# EAGLE design CiderPress (EAGLE 7.5.0)
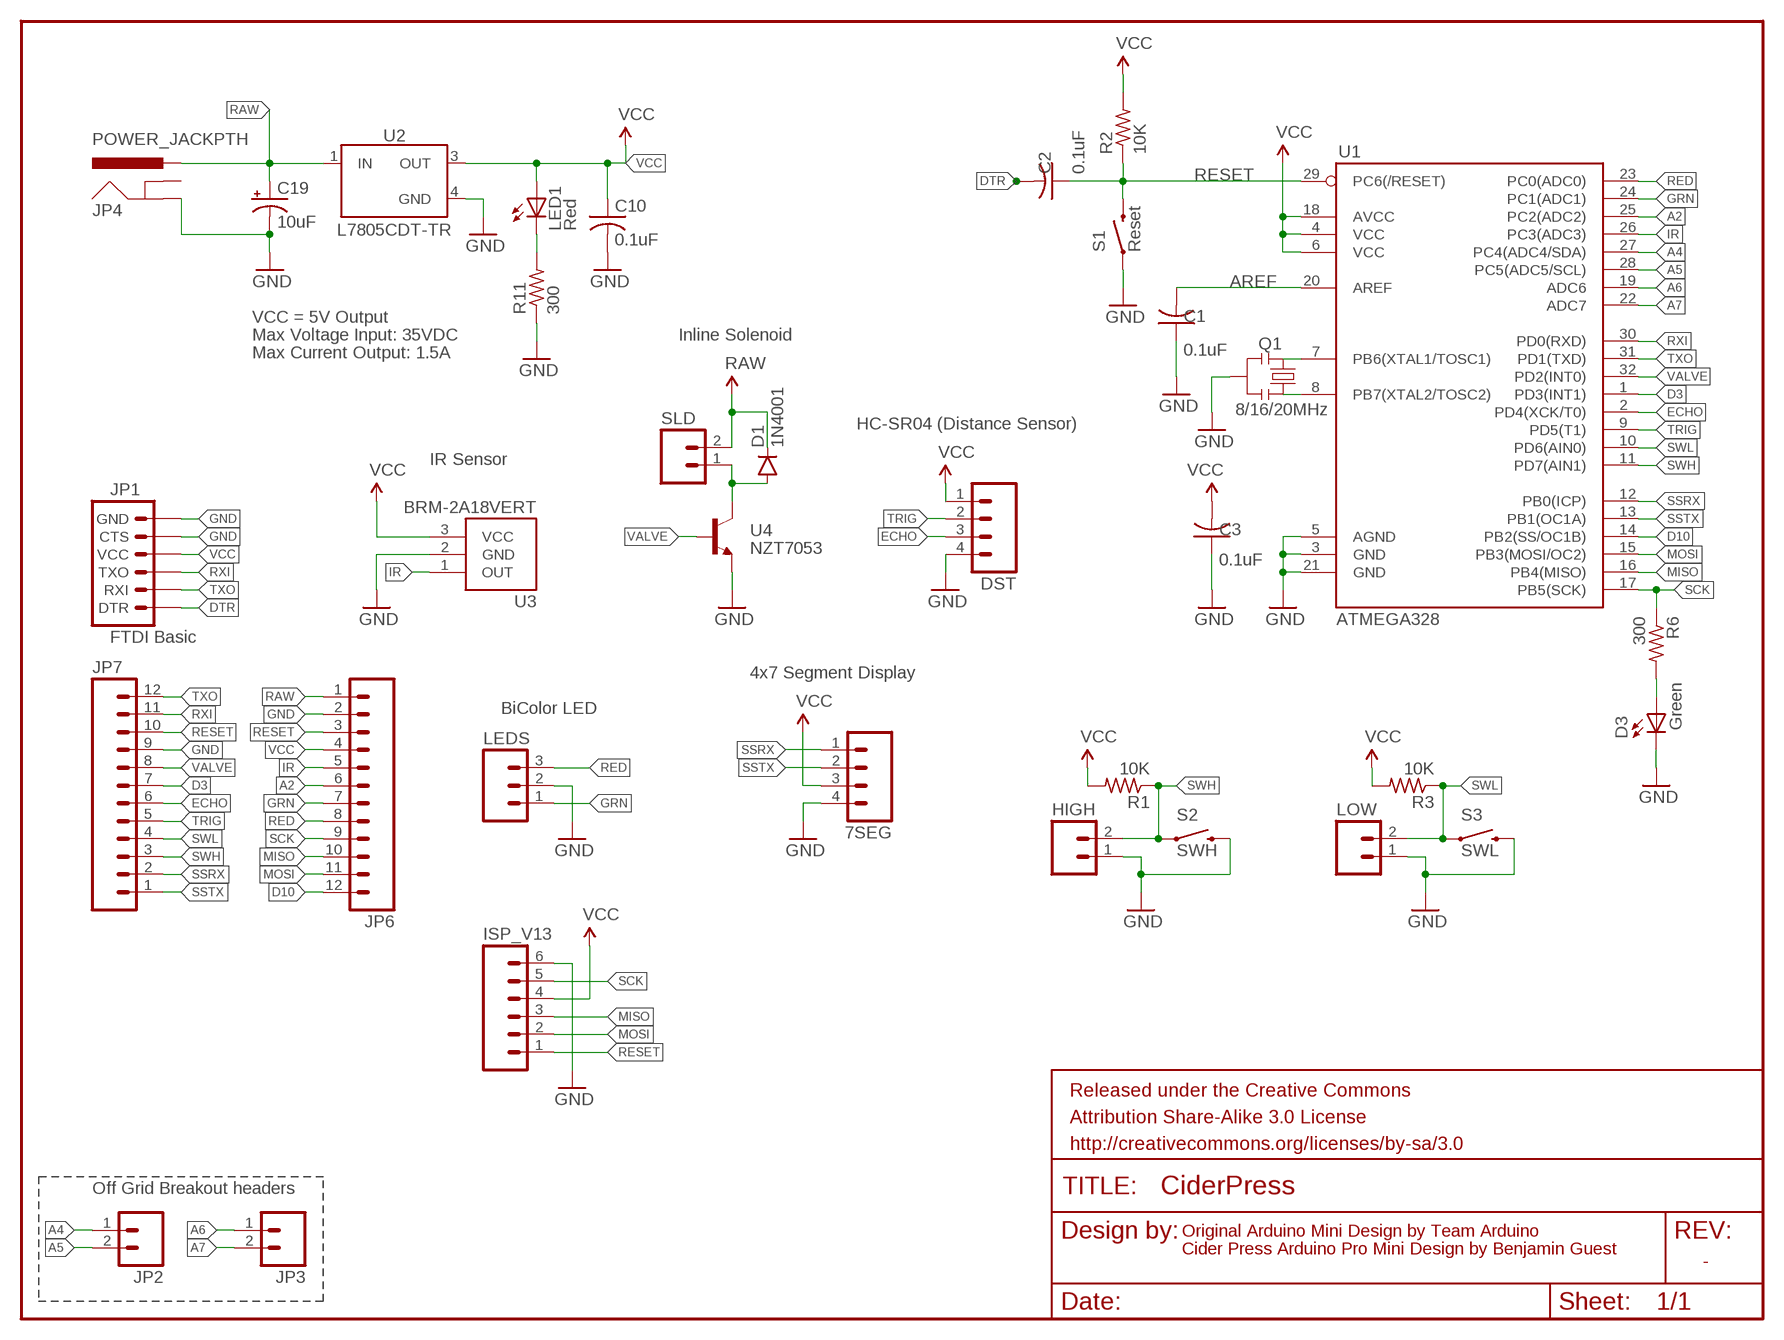
[diagram p0: schematic, sheet 1]

## Parts
7SEG  M04JST-PTH  [JST-4-PTH]
C1  0.1uF  C-USC0805  [C0805]
C2  0.1uF  C-USC0805  [C0805]
C3  0.1uF  C-USC0805  [C0805]
C10  0.1uF  C-USC0805  [C0805]
C19  10uF  CAP_POL1206  [EIA3216]
D1  1N4001  DIODEKIT2  [DIODE-1N4001-KIT]
D3  Green  LEDCHIPLED_0805  [CHIPLED_0805]
DST  M04JST-PTH  [JST-4-PTH]
FRAME1  FRAME-LETTER  [CREATIVE_COMMONS]
HIGH  M02JST-PTH-2  [JST-2-PTH]
ISP_V13  M06SIP  [1X06]
JP1  FTDI Basic  ARDUINO_SERIAL_PROGRAMPTH  [1X06]
JP2  M02PTH  [1X02]
JP3  M02PTH  [1X02]
JP4  POWER_JACKPTH  [POWER_JACK_PTH]
JP6  M12PTH  [1X12]
JP7  M12PTH  [1X12]
LED1  Red  LEDCHIPLED_0805  [CHIPLED_0805]
LEDS  M03JST-PTH  [JST-3-PTH]
LOW  M02JST-PTH-2  [JST-2-PTH]
Q1  8/16/20MHz  RESONATOR1:1  [RESONATOR-SMD-1:1]
R1  10K  R-US_M0805  [M0805]
R2  10K  R-US_M0805  [M0805]
R3  10K  R-US_M0805  [M0805]
R6  300  R-US_M0805  [M0805]
R11  300  R-US_M0805  [M0805]
S1  Reset  SWITCH-MOMENTARY-2SMD-ALT01  [TACTILE-SWITCH-SMD-ALT01]
S2  SWH  SWITCH-MOMENTARY-2SMD-ALT01  [TACTILE-SWITCH-SMD-ALT01]
S3  SWL  SWITCH-MOMENTARY-2SMD-ALT01  [TACTILE-SWITCH-SMD-ALT01]
SLD  M02JST-PTH-2  [JST-2-PTH]
U1  ATMEGA328  ATMEGA168  [TQFP32-08]
U2  L7805CDT-TR  [DPAK]
U3  BRM-2A18VERT  [BRM-2508_VERT]
U4  NZT7053  [SOT-223]

## Nets
A2: JP6.6 U1.25(PC2(ADC2))
A4: JP2.1 U1.27(PC4(ADC4/SDA))
A5: JP2.2 U1.28(PC5(ADC5/SCL))
A6: JP3.1 U1.19(ADC6)
A7: JP3.2 U1.22(ADC7)
AREF: C1.2 U1.20(AREF)
D3: JP7.7 U1.1(PD3(INT1))
D10: JP6.12 U1.14(PB2(SS/OC1B))
DTR: C2.2 JP1.1(DTR)
ECHO: DST.3 JP7.6 U1.2(PD4(XCK/T0))
GND [raw]: 7SEG.4 C1.1 C3.1 C10.2 C19.C(-) D3.C DST.4 HIGH.1 ISP_V13.6 JP1.5(CTS) JP1.6(GND) JP4.GND JP6.2 JP7.9 LEDS.2 LOW.1 Q1.2 R11.1 S1.1 S1.2 S2.3 S2.4 S3.3 S3.4 U1.3(GND) U1.5(AGND) U1.21(GND) U2.4(GND) U3.2(GND) U4.3(E)
GRN: JP6.7 LEDS.1 U1.24(PC1(ADC1))
IR: JP6.5 U1.26(PC3(ADC3)) U3.1(OUT)
MISO: ISP_V13.3 JP6.10 U1.16(PB4(MISO))
MOSI: ISP_V13.2 JP6.11 U1.15(PB3(MOSI/OC2))
N$1: Q1.3 U1.8(PB7(XTAL2/TOSC2))
N$2: Q1.1 U1.7(PB6(XTAL1/TOSC1))
N$4: LED1.C R11.2
N$6: D1.A SLD.1 U4.2(C) U4.4(C)
N$7: D3.A R6.2
RAW [raw]: C19.A(+) D1.C JP4.PWR JP6.1 SLD.2 U2.1(IN)
RED: JP6.8 LEDS.3 U1.23(PC0(ADC0))
RESET: C2.1 ISP_V13.1 JP6.3 JP7.10 R2.1 S1.3 S1.4 U1.29(PC6(/RESET))
RXI: JP1.3(TXO) JP7.11 U1.30(PD0(RXD))
SCK: ISP_V13.5 JP6.9 R6.1 U1.17(PB5(SCK))
SSRX: 7SEG.1 JP7.2 U1.12(PB0(ICP))
SSTX: 7SEG.2 JP7.1 U1.13(PB1(OC1A))
SWH: HIGH.2 JP7.3 R1.1 S2.1 S2.2 U1.11(PD7(AIN1))
SWL: JP7.4 LOW.2 R3.1 S3.1 S3.2 U1.10(PD6(AIN0))
TRIG: DST.2 JP7.5 U1.9(PD5(T1))
TXO: JP1.2(RXI) JP7.12 U1.31(PD1(TXD))
VALVE: JP7.8 U1.32(PD2(INT0)) U4.1(B)
VCC [vcc]: 7SEG.3 C3.2 C10.1 DST.1 ISP_V13.4 JP1.4(VCC) JP6.4 LED1.A R1.2 R2.2 R3.2 U1.4(VCC) U1.6(VCC) U1.18(AVCC) U2.3(OUT) U3.3(VCC)
Unconnected: JP4.GNDBREAK

## Notes on the sheet
- VCC = 5V Output
- Max Voltage Input: 35VDC | Inline Solenoid
- Max Current Output: 1.5A
- HC-SR04 (Distance Sensor)
- IR Sensor
- 4x7 Segment Display
- BiColor LED
- Off Grid Breakout headers
- Original Arduino Mini Design by Team Arduino
- Cider Press Arduino Pro Mini Design by Benjamin Guest
- -

## Library data of the parts
7SEG DST = SparkFun-Connectors:M04: Header 4 Standard 4-pin 0.1" header. Use with straight break away headers (SKU : PRT-00116), right angle break away headers (PRT-00553), swiss pins (PRT-00743), machine pins (PRT-00117), and female headers (PRT-00115). Molex polarized connector foot print use with SKU : PRT-08231 with associated crimp pins and housings. 1MM SMD Version SKU: PRT-10208; SKU: PRT-09916
C1-C3 C10 = adafruit:C-US: CAPACITOR, American symbol
C19 = SparkFun:CAP_POL: Capacitor Polarized These are standard SMD and PTH capacitors. Normally 10uF, 47uF, and 100uF in electrolytic and tantalum varieties. Always verify the external diameter of the through hole cap, it varies with capacity, voltage, and manufacturer. The EIA devices should be standard.
D1 = SparkFun-DiscreteSemi:DIODE: Diode These are standard reverse protection diodes and small signal diodes. SMA package can handle up to about 1A. SOD-323 can handle about 200mA. What the SOD-323 package when ordering, there are some mfgs out there that are 5-pin packages.
D3 LED1 = adafruit:LED: LED OSRAM: - CHIPLED LG R971, LG N971, LY N971, LG Q971, LY Q971, LO R971, LY R971 LH N974, LH R974 LS Q976, LO Q976, LY Q976 LO Q996 - Hyper CHIPLED LW Q18S LB Q993, LB Q99A, LB R99A - SideLED LS A670, LO A670, LY A670, LG A670, LP A670 LB A673, LV A673, LT A673, LW A673 LH A674 LY A675 LS A676, LA A676, LO A676, LY A676, LW A676 LS A679, LY A679, LG A679 - Hyper Micro SIDELED® LS Y876, LA Y876, LO Y876, LY Y876 LT Y87S - SmartLED LW L88C, LW L88S LB L89C, LB L89S, LG L890 LS L89K, LO L89K, LY L89K LS L896, LA L896, LO L896, LY L896 - TOPLED LS T670, LO T670, LY T670, LG T670, LP T670 LSG T670, LSP T670, LSY T670, LOP T670, LYG T670 LG T671, LOG T671, LSG T671 LB T673, LV T673, LT T673, LW T673 LH T674 LS T676, LA T676, LO T676, LY T676, LB T676, LH T676, LSB T676, LW T676 LB T67C, LV T67C, LT T67C, LS T67K, LO T67K, LY T67K, LW E67C LS E67B, LA E67B, LO E67B, LY E67B, LB E67C, LV E67C, LT E67C LW T67C LS T679, LY T679, LG T679 LS T770, LO T770, LY T770, LG T770, LP T770 LB T773, LV T773, LT T773, LW T773 LH T774 LS E675, LA E675, LY E675, LS T675 LS T776, LA T776, LO T776, LY T776, LB T776 LHGB T686 LT T68C, LB T68C - Hyper Mini TOPLED® LB M676 - Mini TOPLED Santana® LG M470 LS M47K, LO M47K, LY M47K Source: http://www.osram.convergy.de/
FRAME1 = SparkFun-Aesthetics:FRAME-LETTER: Schematic Frame Standard 8.5x11 US Letter frame
HIGH LOW SLD = SparkFun-Connectors:M02: Standard 2-pin 0.1" header. Use with - straight break away headers ( PRT-00116) - right angle break away headers (PRT-00553) - swiss pins (PRT-00743) - machine pins (PRT-00117) - female headers (PRT-00115) Molex polarized connector foot print use with: PRT-08233 with associated crimp pins and housings. 2.54_SCREWTERM for use with PRT-10571. 3.5mm Screw Terminal footprints for PRT-08084 5mm Screw Terminal footprints for use with PRT-08432; PROD_ID: CONN-09863; SKU: PRT-09914
ISP_V13 = SparkFun-Connectors:M06: Header 6 Standard 6-pin 0.1" header. Use with straight break away headers (SKU : PRT-00116), right angle break away headers (PRT-00553), swiss pins (PRT-00743), machine pins (PRT-00117), and female headers (PRT-00115). Molex polarized connector foot print use with SKU : PRT-08094 with associated crimp pins and housings. NOTES ON THE VARIANTS LOCK and LOCK_LONGPADS... This footprint was designed to help hold the alignment of a through-hole component (i.e. 6-pin header) while soldering it into place. You may notice that each hole has been shifted either up or down by 0.005 of an inch from it's more standard position (which is a perfectly straight line). This slight alteration caused the pins (the squares in the middle) to touch the edges of the holes. Because they are alternating, it causes a "brace" to hold the component in place. 0.005 has proven to be the perfect amount of "off-center" position when using our standard breakaway headers. Although looks a little odd when you look at the bare footprint, once you have a header in there, the alteration is very hard to notice. Also, if you push a header all the way into place, it is covered up entirely on the bottom side. This idea of altering the position of holes to aid alignment will be further integrated into the Sparkfun Library for other footprints. It can help hold any component with 3 or more connection pins.
JP1 = SparkFun:ARDUINO_SERIAL_PROGRAM
JP2 JP3 = SparkFun:M02: Header 2 Standard 2-pin 0.1" header. Use with straight break away headers (SKU : PRT-00116), right angle break away headers (PRT-00553), swiss pins (PRT-00743), machine pins (PRT-00117), and female headers (PRT-00115). Molex polarized connector foot print use with SKU : PRT-08233 with associated crimp pins and housings.
JP4 = SparkFun-Connectors:POWER_JACK: Power Jack This is the standard 5.5mm barrel jack for power. The PTH is the most common, proven, reliable, footprint. The Slot footprint only works if the mill layer is transmitted to the PCB fab house so be warned. Mating wall wart : TOL-00298 (and others); PROD_ID: CONN-08197
JP6 JP7 = SparkFun:M12: Header 12 Standard 12-pin 0.1" header. Use with straight break away headers (SKU : PRT-00116), right angle break away headers (PRT-00553), swiss pins (PRT-00743), machine pins (PRT-00117), and female headers (PRT-00115).
LEDS = SparkFun-Connectors:M03: Header 3 Standard 3-pin 0.1" header. Use with straight break away headers (SKU : PRT-00116), right angle break away headers (PRT-00553), swiss pins (PRT-00743), machine pins (PRT-00117), and female headers (PRT-00115). Molex polarized connector foot print use with SKU : PRT-08232 with associated crimp pins and housings.; SKU: PRT-09915
Q1 = Testing:RESONATOR: Resonator Small SMD resonator. This is the itty bitty 10/20MHz resonators with built in caps. CSTCE10M0G55 and CSTCE20M0V53. Footprint for SMD has been used in SFE production for years, and does work okay. 1:1 is an attempt to get larger fillets on the sides so it will be easier to inspect these solders in our AOI machine. The pads have been minimized to match the actual metal under the resonator. To see this relation, it includes an image import of the bottom side of the component. Imported to scale on layer 200.
R1-R3 R6 R11 = adafruit:R-US_: RESISTOR, American symbol
S1-S3 = Testing:SWITCH-MOMENTARY-2: Various NO switches- pushbuttons, reed, etc
U1 = SparkFun:ATMEGA168
U2 = BAG:L7805CDT-TR: Description The L78 series of three-terminal positive regulators is available in TO-220, TO-220FP, D²PAK and DPAK packages and several fixed output voltages, making it useful in a wide range of applications. These regulators can provide local on-card regulation, eliminating the distribution problems associated with single point regulation. Each type embeds internal current limiting, thermal shutdown and safe area protection, making it essentially indestructible. If adequate heat sinking is provided, they can deliver over 1 A output current. Although designed primarily as fixed voltage regulators, these devices can be used with external components to obtain adjustable voltage and currents.
U3 = SparkFun-Sensors:BRM-2A18: BRM-2A18 IR receiver.; PROD_ID: COMP-12505
U4 = BAG:NZT7053: TRANS NPN DARL 100V 1.5A SOT223

## Net classes
0 default: width 0.254 mm
1 raw: width 0.508 mm, clearance 0.254 mm
2 vcc: width 0.508 mm, clearance 0.254 mm

## Board
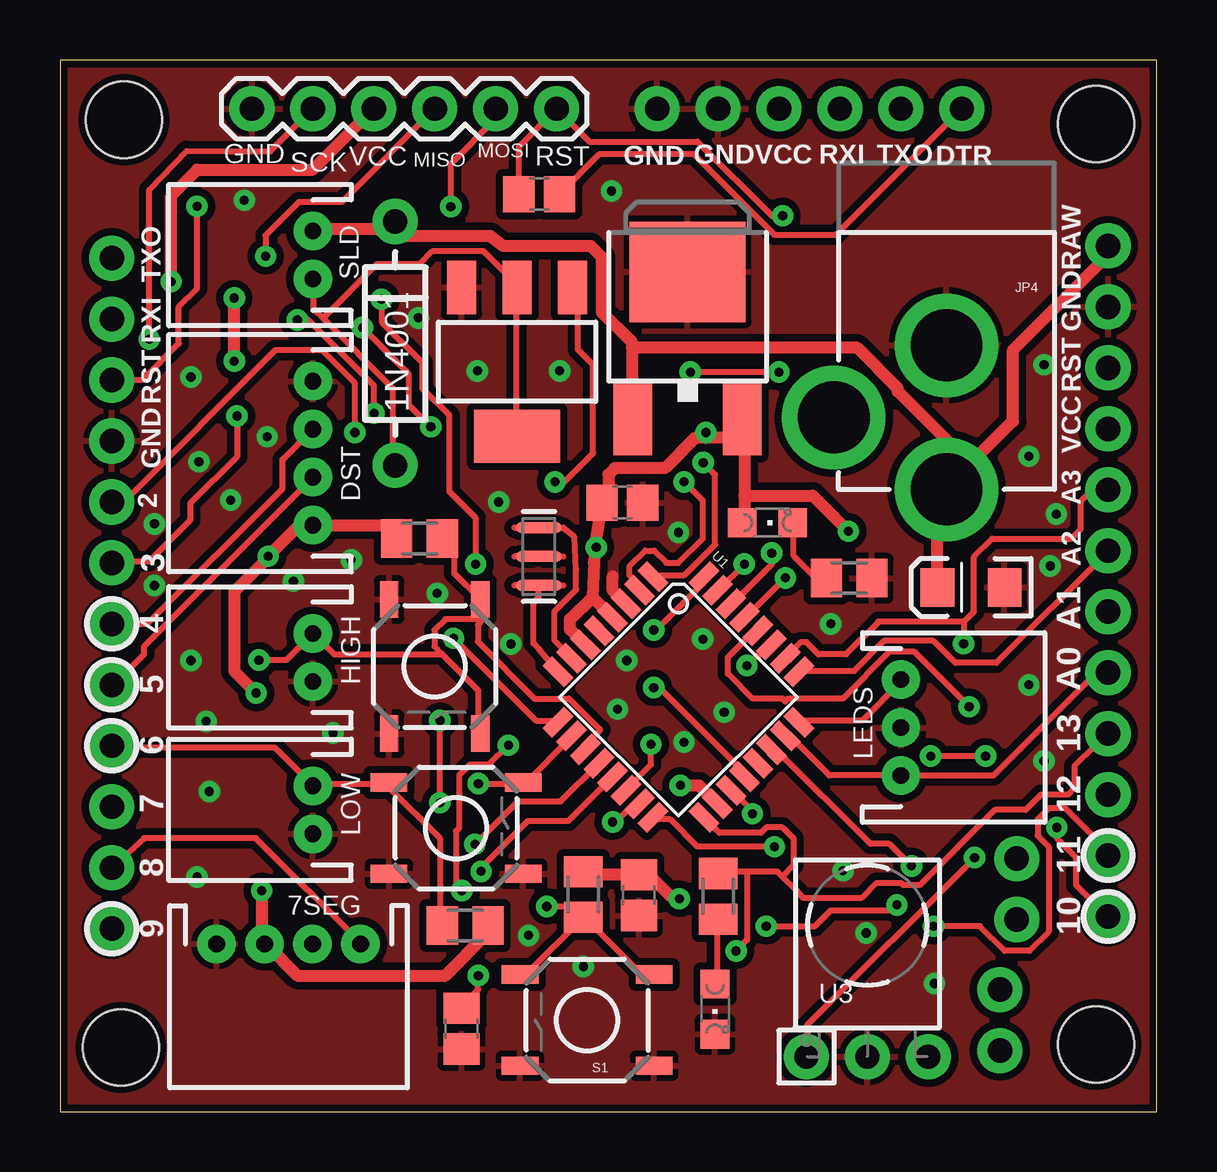
[diagram p1: board, top side]
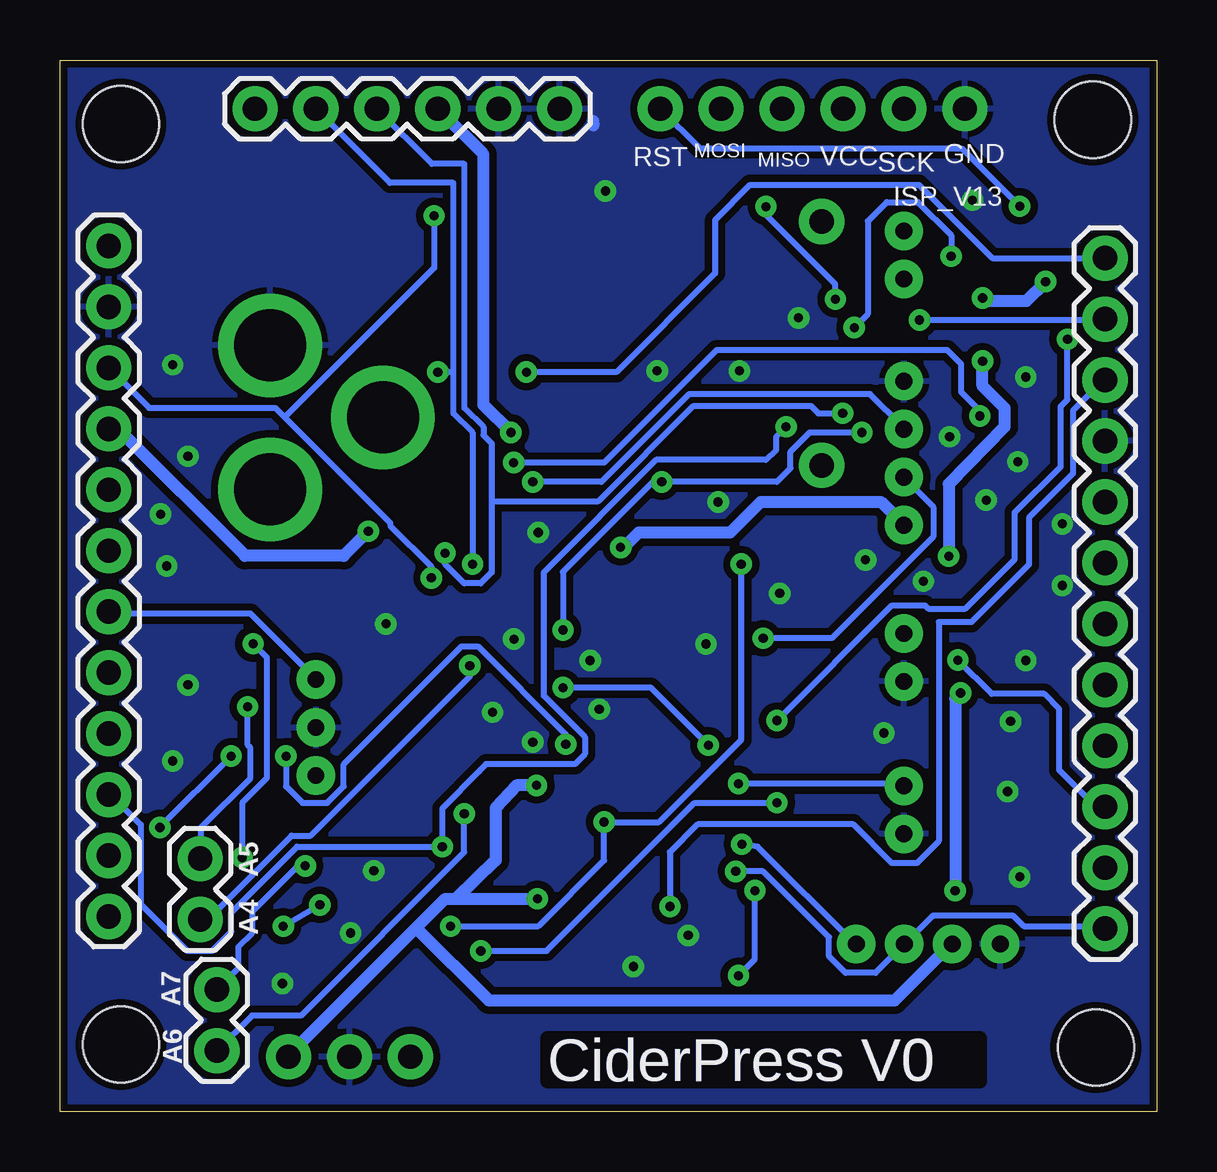
[diagram p2: board, bottom side, seen from below]

Size 45.72 x 43.81 mm. Coordinates in mm from the lower left corner, seen from the top.
Outline: 0,43.81 0,0 45.72,0 45.72,43.81 0,43.81
Copper layers (1*16): Top 0.035mm / dielectric 1.5mm / Bottom 0.035mm
Design rules "SparkFun-2-layer *": minimum track width 8mil, minimum drill 15mil, track to track 8mil, track to pad 8mil, pad to pad 8mil, via to via 8mil, smd to smd 8mil, copper to edge 8mil, drill to drill 8mil, minimum pad ring 12mil, minimum via ring 10mil, stop-mask expansion 4mil, vias tented up to drill 20mil, thermal gap 10mil
Holes 3.17 mm at 43.18,2.79 2.54,2.67 2.67,41.33 43.18,41.15

### Footprints (pad centres in the part's own frame; a part is rotated, then mirrored left to right if it is on the bottom)
JST-4-PTH = drill 0.7 pad 1.6: 1 -3,0; 2 -1,0; 3 1,0; 4 3,0
C0805 = smd 1.3 x 1.5: 1 -0.85,0; 2 0.85,0
EIA3216 = smd 1.4 x 1.6: A 1.4,0; C -1.4,0
DIODE-1N4001-KIT = drill 1.016 pad 1.88: A -5.08,0; C 5.08,0
CHIPLED_0805 = smd 1.2 x 1.2: A 0,-1.05; C 0,1.05
JST-2-PTH = drill 0.7 pad 1.6: 1 -1,0; 2 1,0
1X06 = drill 1.016 pad 1.88: 1 0,0; 2 2.54,0; 3 5.08,0; 4 7.62,0; 5 10.16,0; 6 12.7,0
1X02 = drill 1.016 pad 1.88: 1 0,0; 2 2.54,0
POWER_JACK_PTH = drill 2.997 pad 4.318: GND 0,7.7; GNDBREAK 4.7,10.7; PWR 0,13.7
1X12 = drill 1.016 pad 1.88: 1 0,0; 2 2.54,0; 3 5.08,0; 4 7.62,0; 5 10.16,0; 6 12.7,0; 7 15.24,0; 8 17.78,0; 9 20.32,0; 10 22.86,0; 11 25.4,0; 12 27.94,0
JST-3-PTH = drill 0.7 pad 1.6: 1 -2,0; 2 0,0; 3 2,0
RESONATOR-SMD-1:1 = smd 0.45 x 1.905: 1 -1.2,0; 2 0,0; 3 1.2,0
M0805 = smd 1.3 x 1.6: 1 -0.95,0; 2 0.95,0
TACTILE-SWITCH-SMD-ALT01 = smd 1.524 x 0.762: 1 -2.794,1.905; 2 2.794,1.905; 3 -2.794,-1.905; 4 2.794,-1.905
TQFP32-08 = smd 1.27 x 0.559: 1 -4.293,2.8; 2 -4.293,2; 3 -4.293,1.2; 4 -4.293,0.4; 5 -4.293,-0.4; 6 -4.293,-1.2; 7 -4.293,-2; 8 -4.293,-2.8; 17 4.293,-2.8; 18 4.293,-2; 19 4.293,-1.2; 20 4.293,-0.4; 21 4.293,0.4; 22 4.293,1.2; 23 4.293,2; 24 4.293,2.8 | smd 0.559 x 1.27: 9 -2.8,-4.293; 10 -2,-4.293; 11 -1.2,-4.293; 12 -0.4,-4.293; 13 0.4,-4.293; 14 1.2,-4.293; 15 2,-4.293; 16 2.8,-4.293; 25 2.8,4.293; 26 2,4.293; 27 1.2,4.293; 28 0.4,4.293; 29 -0.4,4.293; 30 -1.2,4.293; 31 -2,4.293; 32 -2.8,4.293
DPAK = smd 1.6 x 3: 1 -2.28,-4.04; 3 2.28,-4.04 | smd 4.826 x 4.191: 4 0,2.096
BRM-2508_VERT = drill 1.016 pad 1.88: 1 -2.54,0; 2 0,0; 3 2.54,0
SOT-223 = smd 1.219 x 2.235: 1 -2.311,-3.099; 2 0,-3.099; 3 2.311,-3.099 | smd 3.6 x 2.2: 4 0,3.099

### Placement (x,y rotation side)
7SEG  9.53,6.99 180 top
C1  16.74,3.45 90 top
C2  19.98,38.23 0 top
C3  24.13,9.02 90 top
C10  23.44,25.37 0 top
C19  37.97,21.84 180 top
D1  13.97,32 90 top
D3  27.3,4.27 180 top
DST  10.54,27.43 90 top
FRAME1  0.53,-8.89 0 top  (outside the outline)
HIGH  10.54,18.92 90 top
ISP_V13  20.7,41.78 180 top
JP1  37.59,41.78 0 bottom
JP2  39.88,8 90 bottom
JP3  39.18,2.54 90 bottom
JP4  36.96,39.62 180 top
JP6  43.69,36.07 270 bottom
JP7  2.16,7.62 90 bottom
LED1  29.49,24.54 270 top
LEDS  35.05,16 270 top
LOW  10.54,12.57 90 top
Q1  19.96,23.13 270 top
R1  14.99,23.88 180 top
R2  21.82,9.04 90 top
R3  16.89,7.75 0 top
R6  27.43,8.97 270 top
R11  32.89,22.23 180 top
S1  21.97,3.81 180 top
S2  15.62,18.54 270 top
S3  16.51,11.81 0 top
SLD  10.54,35.69 90 top
U1  25.78,17.27 315 top
U2  26.16,32.89 0 top
U3  33.66,2.29 0 top
U4  19.05,31.24 180 top

### Tracks (layer width: path | path; a pad name or v marks a point on that pad's centre or on a via)
A2
  Top 0.254: U1.25 30.81,18.35 33.1,18.35 34.35,19.61 36.41,19.61 37.33,18.69 39.04,18.69 43.61,23.27 JP6.6
A4  (via drill 0.38)
  Top 0.254: v28.64,18.58 29.1,19.04 29.21,19.04 29.55,19.38 U1.27
  Bottom 0.254: v28.64,18.58 28.64,18.12 35.27,11.49 36.07,11.49 39.5,8.06 39.84,8.06 JP2.1
A5  (via drill 0.38)
  Top 0.254: v37.9,16.87 35.61,19.15 34.58,19.15 32.64,17.21 30.35,17.21 30.24,17.09 30.12,17.21 28.87,17.21 27.84,18.24 27.84,18.92 28.87,19.95 29.1,19.95 U1.28
  Bottom 0.254: v37.9,16.87 37.9,15.27 37.78,15.15 37.78,13.89 39.84,11.84 39.84,10.58 JP2.2
A6  (via drill 0.38)
  Top 0.254: v28.87,12.41 28.87,12.52 28.07,13.32 U1.19
  Bottom 0.254: v28.87,12.41 28.87,10.81 35.67,4 37.72,4 JP3.1
A7  (via drill 0.38)
  Top 0.254: v35.5,10.24 34.58,11.15 33.78,11.15 29.9,15.04 29.67,15.04 U1.22
  Bottom 0.254: v35.5,10.24 35.8,10.24 37.72,8.32 37.72,7.43 38.29,6.86 38.29,5.97 JP3.2
AREF  (via drill 0.38)
  Top 0.254: v24.75,17.67 24.98,17.67 28.3,14.35 28.3,14.24 28.52,14.01 U1.20 | v18.69,15.27 17.89,14.46 17.09,14.46 16.64,14.01 16.64,11.81 16.51,11.68 16.51,9.45 v16.75,9.21 | v17.44,5.66 17.44,5.09 16.75,4.41 C1.2
  Bottom 0.254: v24.75,17.67 21.09,17.67 v18.69,15.27 | v16.75,9.21 16.75,6.35 v17.44,5.66
D3  (via drill 0.38)
  Top 0.254: U1.1 24.75,22.35 26.04,22.35 27.3,23.62 27.3,26.54 v26.81,27.04 | v7.38,28.98 7.38,27.29 5.44,25.35 5.44,24.64 3.72,22.92 2.54,22.92 | 2.23,22.92 2.54,22.92 | JP7.7 2.54,22.86 2.54,22.92
  Bottom 0.254: v26.81,27.04 23.04,27.04 18.35,31.73 8.74,31.73 8.15,31.14 8.15,29.97 7.38,29.2 v7.38,28.98
D10  (via drill 0.38)
  Top 0.254: v38.58,14.81 v36.3,14.81 | v41.55,11.84 41.55,11.38 42.35,10.58 42.35,9.44 43.61,8.18 JP6.12 | U1.14 23.61,13.44 24.64,14.46 v24.64,15.3
  Bottom 0.254: v24.64,15.3 24.64,15.72 28.3,19.38 28.98,19.38 33.9,14.46 33.9,13.55 34.58,12.87 35.61,12.87 36.3,13.55 v36.3,14.81 | v41.55,11.84 v38.58,14.81
DTR
  Top 0.254: JP1.1 32.33,36.52 29.78,36.52 26.43,39.88 22.48,39.88 C2.2
ECHO  (via drill 0.38)
  Top 0.254: U1.2 24.07,21.78 24.07,22.01 23.72,22.35 23.72,22.7 24.4,23.37 24.77,23.37 25.27,22.86 25.78,22.86 26.8,23.88 26.8,25.45 v26.01,26.24 | JP7.6 3.63,20.32 9.27,25.96 9.27,27.16 DST.3
  Bottom 0.254: v26.01,26.24 23.15,26.24 19.49,29.9 11.95,29.9 10.58,28.52 DST.3
GND  (via drill 0.38)
  Top 0.508: U1.3 23.04,21.71 23.04,22.3
  Bottom 0.508: 23.5,41.27 23.48,41.09
  other vias: 6.22,13.34 5.46,18.8 5.46,30.61 22.99,38.35 20.83,30.86 23.62,18.8 26.8,19.68 27.69,16.64 36.45,5.33 25.78,24.13 18.29,25.4 23.24,16.76 26.01,15.39 41.27,22.73 40.39,17.78 5.71,9.78 6.1,16.26 17.4,30.86 41.02,31.11 40.39,27.3 41.53,24.89 41.02,14.61 32.13,20.32 32.64,10.03 33.6,7.44 14.94,33.07 18.8,19.48 15.72,21.59 11.38,15.77 3.94,24.49 12.14,22.99 9.73,22.1 5.79,27.08 3.94,21.92 7.11,25.48 8.64,28.12 21.82,6.05 19.53,7.34 7.68,37.97
  pour Top (isolate 0.305): 0,43.81 45.72,43.81 45.72,0 0,0
  pour Bottom (isolate 0.305): 0,43.81 45.72,43.81 45.72,0 0,0
GRN
  Top 0.254: U1.24 30.81,16.29 33.44,16.29 35.04,17.89 LEDS.1
  Bottom 0.254: JP6.7 43.61,20.75 37.78,20.75 LEDS.1
IR  (via drill 0.38)
  Top 0.254: 30.47,18.92 30.24,18.92 U1.26 30.89,19.56 31.11,19.56 31.62,19.05 32.77,19.05 34.11,20.4 34.11,20.41 37.67,20.41 | JP6.5 43.61,25.89 43.02,25.89 42.55,25.43 42.55,24.26 42.16,23.88 38.86,23.88 38.1,23.11 38.1,20.83 37.68,20.41 37.67,20.41 | v38.12,10.58 31.15,3.61 31.15,2.35 U3.1 | 37.67,20.41 v37.67,19.49
  Bottom 0.254: v38.12,10.58 38.12,12.87 37.1,13.89 37.1,18.92 v37.67,19.49
MISO  (via drill 0.38)
  Top 0.254: v29.78,11.04 26.58,11.04 25.44,12.18 24.75,12.18 U1.16 | v12.61,32.66 14.54,30.73 14.54,29.45 v15.46,28.54 | ISP_V13.3 11.73,37.9 9.96,37.9 8.57,36.51 v8.57,35.64
  Bottom 0.254: JP6.10 43.61,13.21 42.35,11.95 42.35,8.64 40.41,6.69 39.38,6.69 38.58,7.49 38.58,8.29 35.84,11.04 v29.78,11.04 29.78,12.64 28.25,14.17 27.96,14.48 24.26,14.48 23.84,14.9 23.84,15.61 25.55,17.32 25.55,22.47 20.87,27.15 16.29,27.15 15.88,27.56 15.88,28.11 v15.46,28.54 | v12.61,32.66 12.05,33.22 12.05,37.1 11.25,37.9 9.96,37.9 8.57,36.51 v8.57,35.64
MOSI  (via drill 0.38)
  Top 0.254: v23.04,12.06 23.15,12.06 23.84,12.75 24.07,12.75 U1.15 | v36.41,7.72 38.35,7.72 39.38,6.69 40.41,6.69 41.21,7.49 41.21,11.04 40.75,11.49 40.75,12.18 41.21,12.64 41.9,12.64 43.61,10.92 43.61,10.69 JP6.11 | v16.29,37.71 16.29,39.5 18.16,41.36 ISP_V13.2 | v29.44,7.72 31.47,7.72 32.13,8.38 34.66,8.38 v34.89,8.61 | v13.4,33.85 13.44,33.81 13.44,32.87 15.11,31.19 15.11,30.12 16.23,29.01 16.23,25.83 17.32,24.74 v17.32,22.81
  Bottom 0.254: v29.44,7.72 25.78,7.72 23.04,10.46 v23.04,12.06 20.75,12.06 17.32,15.49 v17.32,22.81 | v36.41,7.72 v34.89,8.61 | v13.4,33.85 13.4,34.48 16.29,37.38 v16.29,37.71
N$1
  Top 0.254: U1.8 19.96,19.29 19.74,19.51 19.74,21.16 19.96,21.46 Q1.3
N$2
  Top 0.254: U1.7 20.62,19.62 20.62,20.85 21.51,21.74 21.51,22.58 21.44,23.95 20.97,24.33
N$4
  Top 0.254: LED1.C 30.58,24.52 30.58,23.15 31.84,21.89 R11.2
N$6
  Top 0.254: U4.4 19.04,28.18 19.04,34.24 U4.2 19.04,34.47 17.67,35.84 15.52,35.84 14.99,35.31 13.21,35.31 10.96,33.06 | 10.96,33.06 13.89,30.12 13.89,26.92 D1.A | 10.96,33.06 10.58,33.44 10.58,34.58 SLD.1
N$7
  Top 0.254: D3.A 27.38,5.32 27.38,7.95 R6.2
RAW
  Top 0.508: C19.A 36.57,25.8 JP4.PWR | JP6.1 43.61,36.07 43.61,35.61 39.73,31.73 39.73,28.75 37.1,26.12 JP4.PWR | 23.84,31.84 23.84,32.07 22.58,33.33 22.58,35.61 22.12,36.07 18.48,36.07 17.93,36.49 14.12,36.49 14.01,36.6 D1.C 13.26,36.75 10.58,36.75 SLD.2 | 23.84,31.84 23.84,28.87 U2.1 | 23.84,31.84 33.21,31.84 34.92,30.12 34.92,30.01 37.78,27.15 JP4.PWR
RED
  Top 0.254: U1.23 30.24,15.61 30.47,15.61 32.07,14.01 LEDS.3 35.15,14.01 38.92,14.01 43.16,18.24 43.61,18.24 JP6.8
RESET  (via drill 0.38)
  Top 0.254: v30.24,22.24 28.64,20.64 U1.29 | S1.4 19.27,5.78 19.49,5.78 21.78,8.06 R2.1 | 21.89,8.06 22.28,7.68 | 22.28,7.68 24.18,5.78 24.75,5.78 S1.3 | v30.12,37.33 29.67,37.33 26.58,40.41 22.07,40.41 ISP_V13.1 19.13,40.21 C2.1 | v20.3,8.55 21.36,8.55 R2.1 | R2.1 22.23,7.62 22.28,7.68 | v5.71,37.72 5.71,34.29 4.95,33.53 4.95,32 3.43,30.48 JP7.10 2.79,30.48
  Bottom 0.254: v30.24,22.24 30.24,22.7 31.95,24.41 31.95,24.52 36.35,28.92 | 36.35,28.92 36.75,29.32 42.01,29.32 43.61,30.92 JP6.3 | v20.3,8.55 20.3,10.81 19.14,11.96 12.65,11.96 11.04,10.35 10.01,10.35 9.09,11.27 9.09,20.4 7.72,20.4 5.33,22.78 5.33,24.74 3.49,26.58 3.49,29.21 2.22,30.48 JP7.10 | 36.35,28.92 30.12,35.15 v30.12,37.33 | 20.78,41.71 ISP_V13.1 19.05,40.13 8.13,40.13 v5.71,37.72
RXI  (via drill 0.38)
  Top 0.254: v29.67,23.27 29.67,22.81 28.07,21.21 U1.30 | v9.89,32.98 10.35,32.98 13.09,30.24 v13.09,29.1
  Bottom 0.254: v29.67,23.27 29.67,22.81 28.87,22.01 28.18,22.01 27.72,22.47 27.72,25.44 | 27.72,25.44 27.72,27.84 28.07,28.18 28.07,28.52 28.87,29.32 28.87,39.48 30.21,39.48 JP1.3 | v9.89,32.98 2.23,32.98 JP7.11 | 27.72,25.44 23.27,25.44 19.3,29.4 14.41,29.4 14.11,29.1 v13.09,29.1
SCK  (via drill 0.38)
  Top 0.254: 28.64,10.01 27.5,10.01 R6.1 | 28.64,10.01 29.9,10.01 30.11,9.79 | U1.17 26.92,12.18 27.5,11.61 29.21,11.61 29.44,11.84 30.12,11.84 30.58,11.38 30.58,10.26 30.11,9.79 | v15.84,12.87 v15.84,16.29 | v28.18,6.69 28.64,7.15 28.64,10.01 | v3.72,32.18 3.72,38.42 5.28,40.03 6.99,40.01 8.76,40.01 ISP_V13.5 | 43.61,15.72 43.16,15.27 | 43.16,15.27 42.29,14.4 42.29,13.46 42.04,13.21 40.89,13.21 40.26,12.57 38.98,12.57 35.84,9.44 35.15,9.44 35.06,9.53 34.04,9.53 33.43,8.91 30.96,8.91 30.71,9.2 30.11,9.79 | JP6.9 43.18,15.24 43.16,15.27
  Bottom 0.254: v3.72,32.18 3.72,29.67 4.01,29.38 4.01,26.85 5.92,24.97 5.92,23.01 7.98,20.95 9.53,20.95 9.66,21.09 11.04,21.09 v15.84,16.29 | v15.84,12.87 19.27,12.87 25.44,6.69 v28.18,6.69
SSRX  (via drill 0.38)
  Top 0.254: 22.35,14.46 U1.12 20.87,12.93 19.09,12.93 v17.3,11.14 | JP7.2 3.5,11.39 8.17,11.39 12.52,7.04 7SEG.1
  Bottom 0.254: v17.3,11.14 16.64,11.04 12.64,7.04 7SEG.1
SSTX  (via drill 0.38)
  Top 0.254: 22.92,13.66 22.92,13.89 U1.13 21.19,12.12 19.51,12.12 17.55,10.16 v17.55,10.01
  Bottom 0.254: v17.55,10.01 16.41,10.01 13.66,7.26 13.66,6.46 12.98,5.78 11.72,5.78 10.58,6.92 7SEG.2 10.46,7.04 9.32,8.18 6.01,8.18 5.55,7.72 2.23,7.72 JP7.1
SWH  (via drill 0.38)
  Top 0.254: 17.55,20.52 17.55,21.32 S2.1 16.43,22.43 16.43,23.38 R1.1 | 17.55,20.52 17.55,20.41 17.42,20.28 17.42,19.58 19.77,17.21 21.21,17.21 22.35,16.07 22.53,15.9 22.01,15.38 22.01,15.15 U1.11 | 15.91,19.08 15.61,19.38 15.61,20.07 16.07,20.52 17.55,20.52 | 15.91,19.08 17.44,17.55 17.44,15.84 S2.2 | 10.58,19.95 HIGH.2 | v8.29,18.81 9.44,18.81 10.46,19.84 HIGH.2 | 15.91,19.08 15.88,19.05 11.43,19.05 10.79,19.68 HIGH.2
  Bottom 0.254: JP7.3 2.54,12.7 4.06,14.22 4.06,16.76 4.7,17.4 6.88,17.4 v8.29,18.81
SWL  (via drill 0.38)
  Top 0.254: U1.10 21.32,15.61 19.38,13.66 S3.2 19.27,13.66 v17.44,13.66 | R3.1 15.84,7.84 15.84,11.38 13.66,13.55 S3.1 13.66,13.66 10.58,13.66 LOW.2 10.46,13.66 8.98,15.15 2.23,15.15 JP7.4
  Bottom 0.254: v17.44,13.66 10.58,13.66 LOW.2
TRIG  (via drill 0.38)
  Top 0.254: v16.41,19.72 19.84,16.29 20.75,16.29 U1.9 | 10.46,26.35 DST.2 10.54,26.42 3.5,19.38 3.5,19.05 2.23,17.78 JP7.5
  Bottom 0.254: v16.41,19.72 13.55,19.72 9.32,23.95 9.32,25.21 10.46,26.35 DST.2
TXO  (via drill 0.38)
  Top 0.254: v28.52,22.81 27.5,21.78 U1.31 | v29.97,30.81 v26.28,30.81
  Bottom 0.254: v28.52,22.81 28.52,28.3 29.32,29.1 29.32,30.81 | 29.32,30.81 29.32,38.7 31.97,38.7 JP1.2 | 9.87,38.57 9.77,38.47 | 29.32,30.81 v29.97,30.81 | v26.28,30.81 22.53,30.81 18.41,34.92 18.41,37.15 16.95,38.61 9.91,38.61 9.77,38.47 | 9.77,38.47 6.86,35.56 JP7.12
VALVE  (via drill 0.38)
  Top 0.254: v24.75,20.07 24.87,20.07 26.81,22.01 26.81,22.24 U1.32 | 21.78,33.9 21.44,34.24 U4.1 21.59,34.29 21.59,31.75 22.23,31.11 22.23,27.43 20.95,26.16 v20.64,26.24 | v12.29,28.3 12.29,30.35 10.92,31.73 8.98,31.73 2.69,25.44 2.23,25.44 JP7.8
  Bottom 0.254: v24.75,20.07 24.75,22.49 21.01,26.24 v20.64,26.24 15.84,26.24 15.27,26.81 15.27,27.5 14.46,28.3 v12.29,28.3
VCC  (via drill 0.38)
  Top 0.508: 22.3,23.56 22.25,22.87 22.19,21.43 | 22.19,21.43 U1.4 | R3.2 17.78,7.72 17.78,7.38 16.07,5.66 9.89,5.66 8.64,6.92 7SEG.3 8.41,7.15 v8.41,9.21 | v25.82,8.87 25.67,8.87 25.44,8.98 24.55,9.87 C3.2 21.94,9.87 R2.2 | v7.26,31.27 v7.26,33.9 | 28.52,25.67 28.52,28.75 U2.3 28.3,28.07 26.92,28.07 | 28.52,25.67 28.52,24.64 LED1.A | 26.92,28.07 26.47,28.07 25.21,26.81 23.13,26.81 22.86,26.54 22.86,25.64 C10.1 22.58,25.11 22.3,23.56 | v26.92,28.3 26.92,28.07 | v32.87,24.18 31.38,25.67 28.52,25.67 | v22.35,23.51 22.3,23.56 | v8.18,17.44 7.26,18.35 7.26,21.67 8.64,23.04 v8.67,23.14 9.97,24.43 DST.1 13.48,24.43 R1.2 | v4.64,34.58 4.64,38.16 5.71,39.24 10.54,39.24 ISP_V13.4 | v25.86,13.59 26.64,13.59 U1.18 | U1.6 21.26,20.1 21.26,20.52 22.19,21.43 | 22.19,21.43
  Bottom 0.508: 29.21,8.87 29.67,8.87 30.87,7.66 | 29.21,8.87 v25.82,8.87 | 30.87,7.66 36.18,2.35 U3.3 | 30.87,7.66 27.84,4.64 10.92,4.64 8.64,6.92 7SEG.3 | v4.64,34.58 5.44,33.78 7.15,33.78 v7.26,33.9 | v7.26,31.27 7.26,30.24 6.35,29.32 6.35,28.52 8.67,26.15 v8.67,23.14 | v26.92,28.3 28.07,29.44 28.07,39.88 JP1.4 | v32.87,24.18 33.9,23.15 38.01,23.15 43.27,28.41 43.61,28.41 JP6.4 | v8.41,9.21 8.41,17.21 v8.18,17.44 | v25.86,13.59 26.7,13.59 27.56,12.65 27.56,10.46 29.21,8.87 | v22.35,23.51 22.23,23.5 21.59,24.13 17.78,24.13 16.51,25.4 11.51,25.4 DST.1

### Text on the board
Bottom: CiderPress V0
tPlace: GND | MOSI | GND | DTR | SCK | VCC | MISO | RST | GND | VCC | RXI | TXO | TXO | RAW | GND | RXI | RST | RST | GND | VCC | 2 | A3 | A2 | 3 | 4 | A1 | A0 | 5 | 6 | 13 | 7 | 12 | 8 | 11 | 9 | 10
bPlace: GND | MOSI | SCK | VCC | MISO | RST | A5 | A4 | A7 | A6
bNames: CiderPress V0
Document: Valid combinations: | 168V / 3.3V Reg / 8MHz | 168 / 5V Reg / 16MHz | 168 / 5V Reg / 20MHz | Mark back accordingly
tDocu: Original Arduino Mini Design by Team Arduino / Arduino Pro Mini Design by SparkFun Electronics / Revised by Pete Lewis, CiderPress by Benjamin Guest